# Altium project Breadboard Indicator LED.PrjPcb
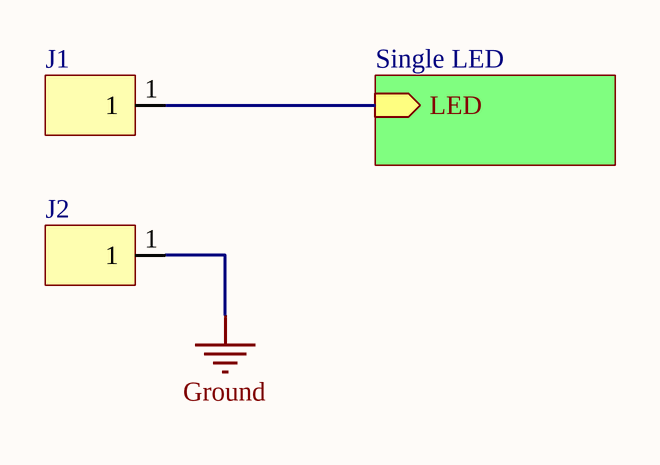
[diagram p0: Block Diagram.SchDoc]
ColourSilkscreen: White; ColourSoldermask: Purple; Company: Your Company Name; ECNPCB: N/A; Finish: ENIG; FlamabilityRating: 94V-0; NamePCB: Breadboard Indicator LED; NumberOfLayers: 2; ProcessType: Lead Free RoHS; ProjectRevision: 0; ReleaseDatePCB: 2023-01-01; ReleasedByPCB: Craig Comberbach; ValidatedBy: Not Been Validated; VerifiedBy: Not Been Verified; VersionPCB: 0
2 sheets, 4 parts. Net scope: hierarchical (ports join the sheet entries above them; power ports are global).
Board file: Single LED.PcbDoc
Sheets:
  Block Diagram.SchDoc
    Single LED = Single LED.SchDoc

## Sheet Block Diagram.SchDoc: Block Diagram
size A4; DocumentNumber: 1; SheetNumber: 1; SheetTotal: 2

### Parts
J1  Connector Breadboard 1-Pin  [Connector Samtec HW Series 1-Pin]  (value not drawn)
J2  Connector Breadboard 1-Pin  [Connector Samtec HW Series 1-Pin]  (value not drawn)

### Sub-sheets
Single LED = Single LED.SchDoc: LED (in)

### Nets
Ground: J2.1
NetJ1_1: J1.1 ; sheet Single LED/LED

### Library data of the parts
J1 J2 = Connector Breadboard 1-Pin: Manufacturer: Samtec; Manufacturer Part Number: HW-01-08-G-S-200-265; Process Type: THT; Max Operating Temperature: 125ºC; Min Operating Temperature: -55ºC

## Sheet Single LED.SchDoc: Indicator LED
size A4; DocumentNumber: 2; SheetNumber: 2; SheetTotal: 2
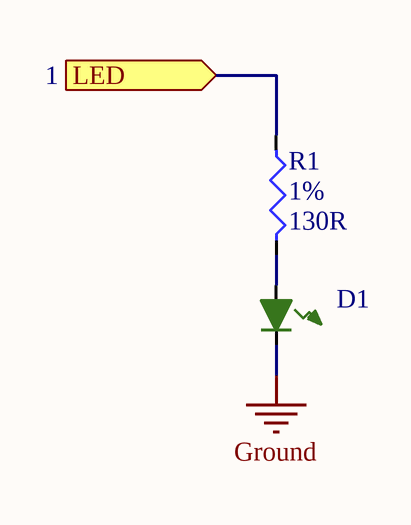
[diagram p1: Single LED.SchDoc]

### Parts
D1  LED Green 0603 Signal 571nm  [0603 LED Green]  (value not drawn)
R1  Tolerance: 1%  Resistance: 130R  [0603 Resistor]  (hidden comment: Resistor 130R 0603 1%)

### Ports
LED (in, see 1)

### Nets
Ground: D1.2
NetD1_1: D1.1 R1.1
NetJ1_1: R1.2 ; port LED

### Library data of the parts
D1 = LED Green 0603 Signal 571nm: Manufacturer: Lite-On Inc.; Manufacturer Part Number: LTST-C191KGKT; Process Type: SMT; Current Rating: 30mA; ComponentLink1Description: Spec Sheet; Max Operating Temperature: 85ºC; Min Operating Temperature: -55ºC; Package: 0603; Wavelength: 571nm
R1 = Resistor 130R 0603 1%: Manufacturer: Yageo; Manufacturer Part Number: RC0603FR-07130RL; Process Type: SMT; Power Rating: 100mW; Voltage Rating: 75V; ComponentLink1Description: Data Sheet; Max Operating Temperature: 155ºC; Min Operating Temperature: -55ºC; Package: 0603

## Nets that join several sheets
Ground: Block Diagram (J2.1), Single LED (D1.2)
NetJ1_1: Block Diagram (J1.1), Single LED (R1.2)

## Assembly variants
Green LED: all parts fitted